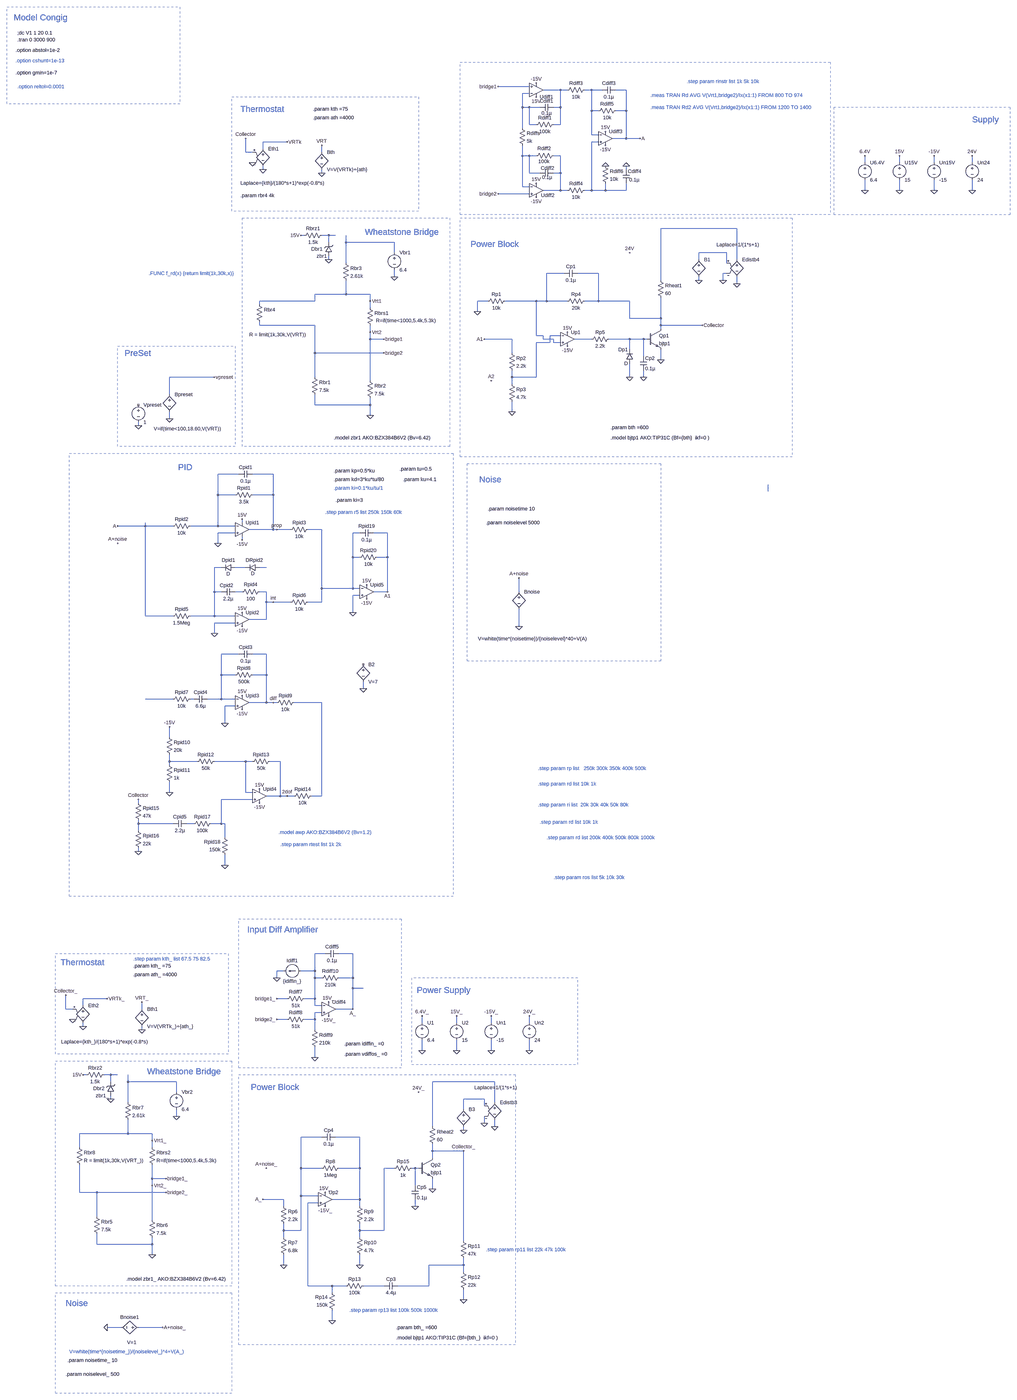
[diagram p0: schematic pid_temp2.asc, whole sheet]
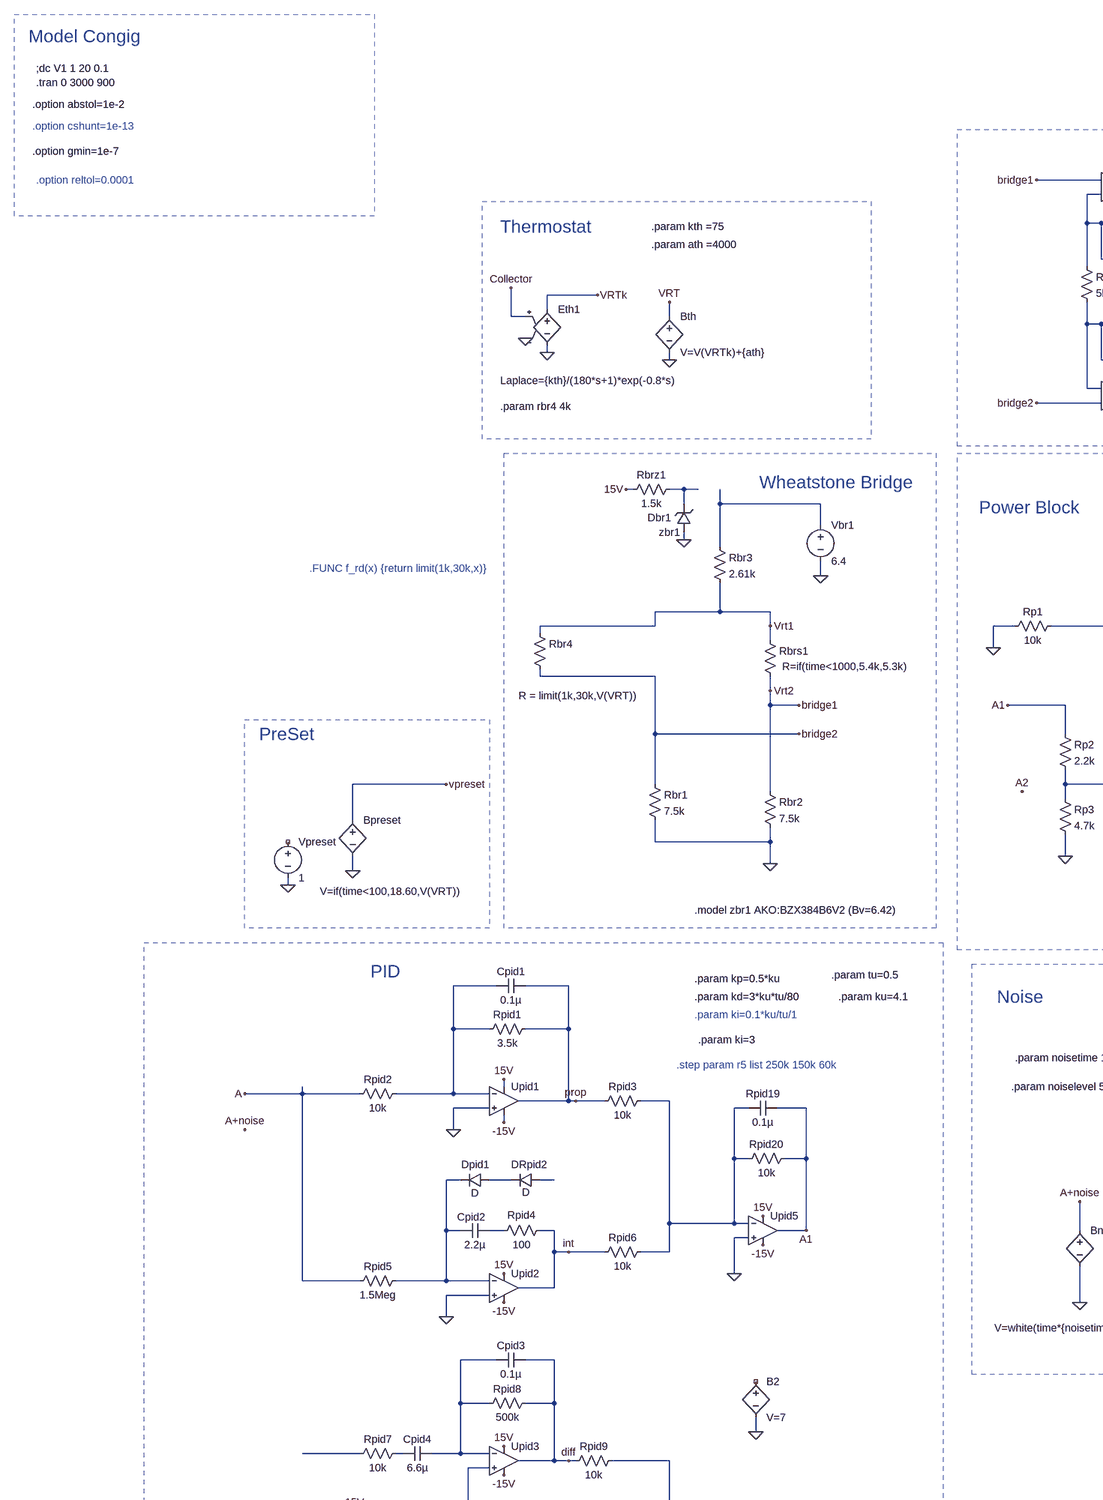
[diagram p1: schematic pid_temp2.asc, part, row 1 of 2, column 1 of 2]
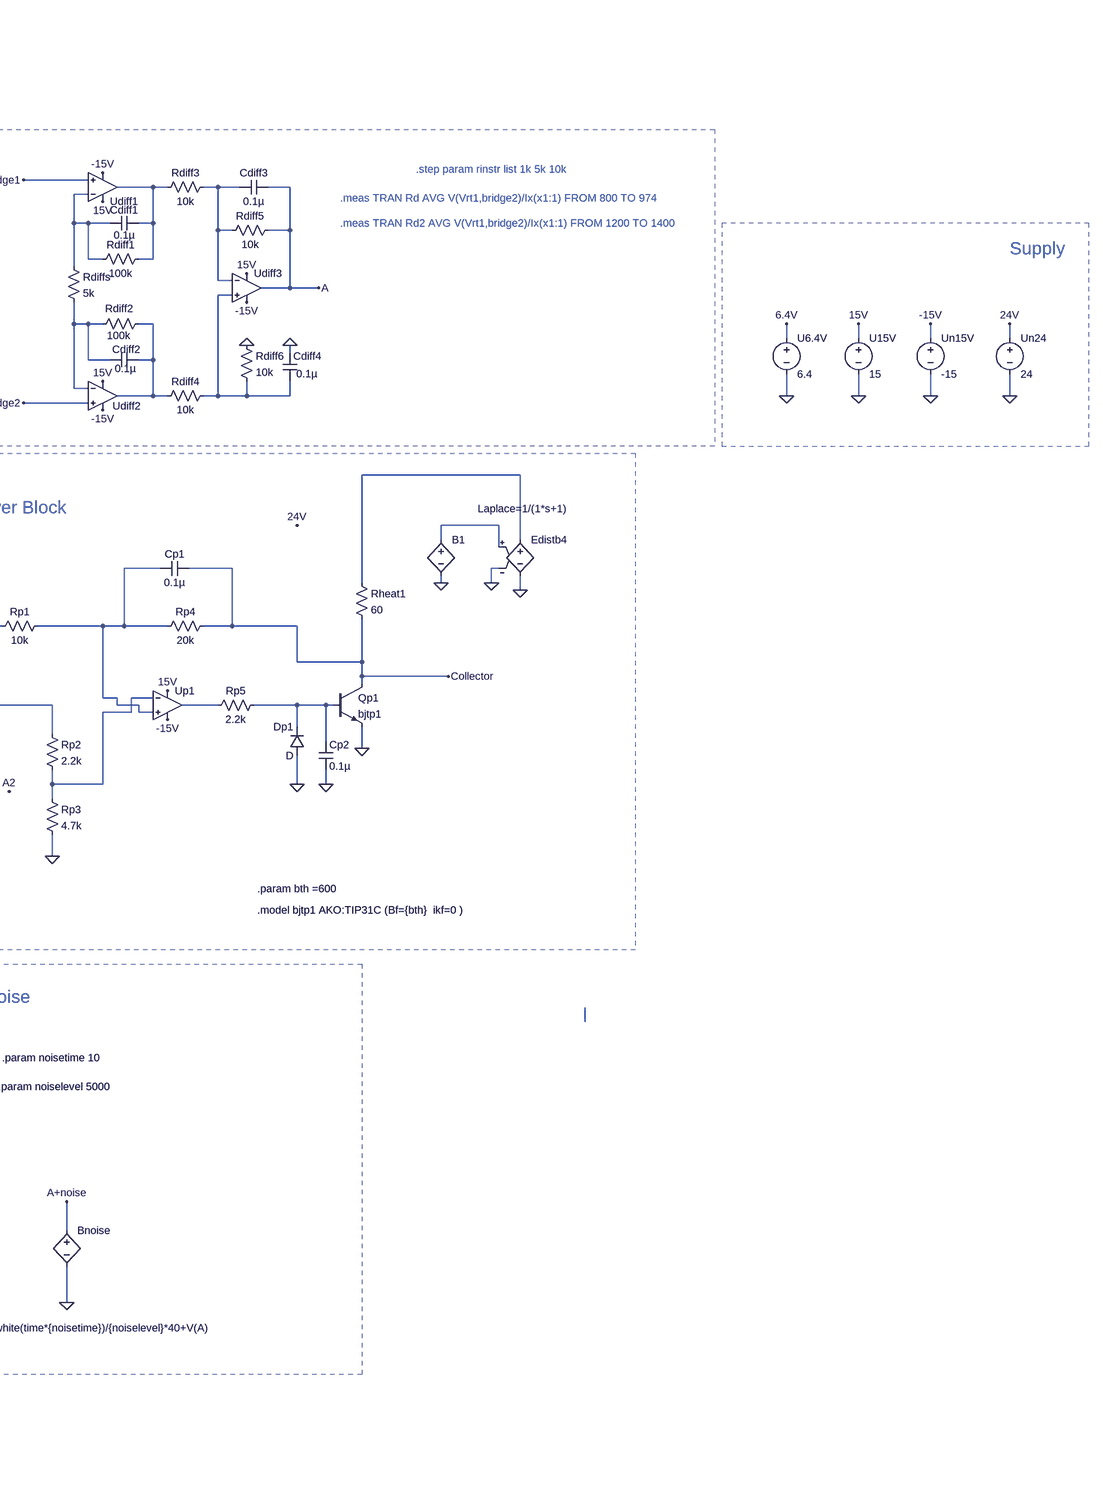
[diagram p2: schematic pid_temp2.asc, part, row 1 of 2, column 2 of 2]
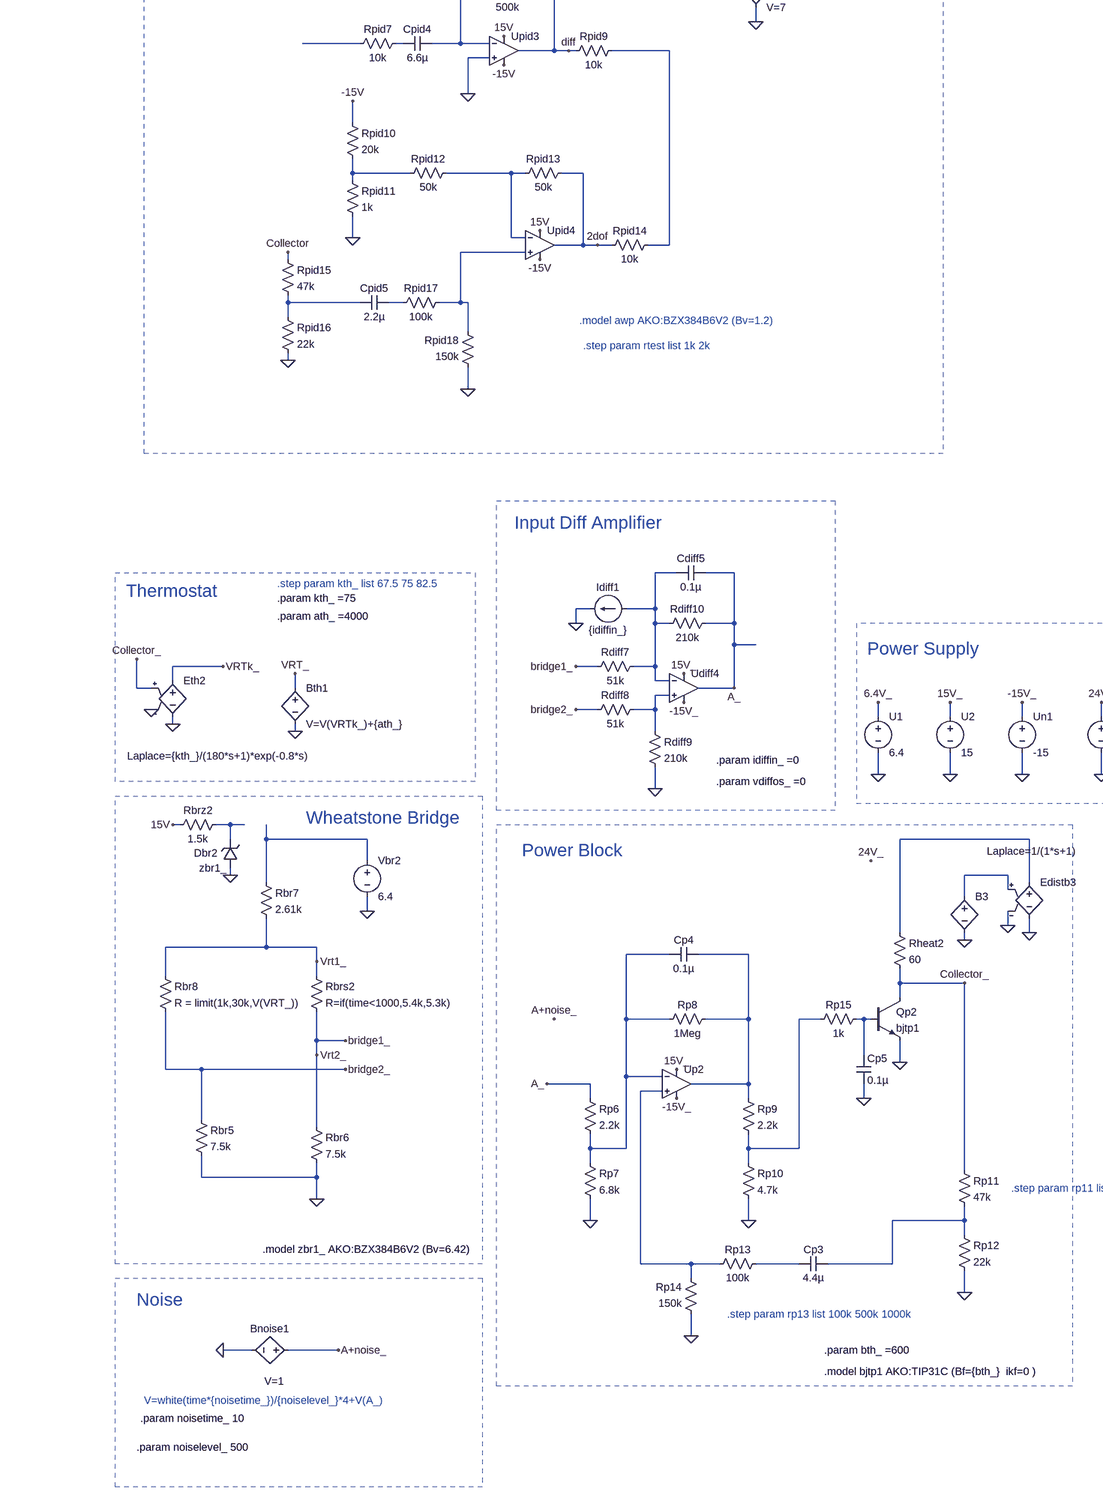
[diagram p3: schematic pid_temp2.asc, part, row 2 of 2, column 1 of 2]
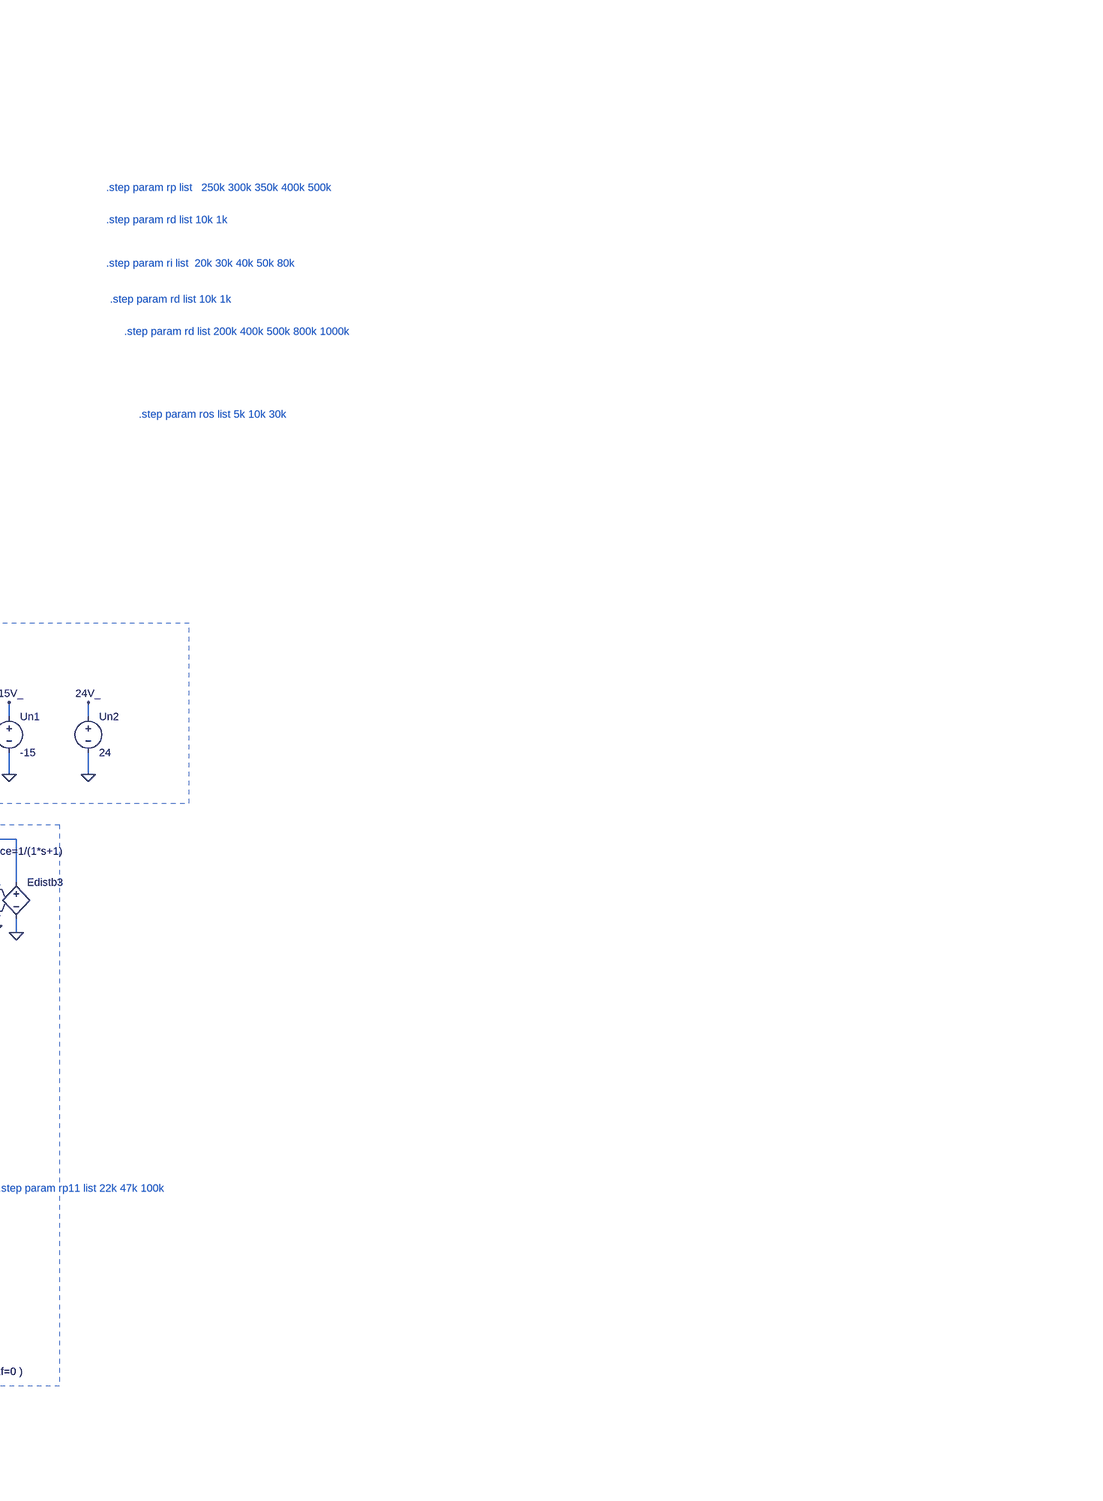
[diagram p4: schematic pid_temp2.asc, part, row 2 of 2, column 2 of 2]
pid_temp2.asc, the LTspice schematic file:
Version 4
SHEET 1 1740 5892
WIRE -720 -864 -864 -864
WIRE -576 -848 -656 -848
WIRE -544 -848 -576 -848
WIRE -432 -848 -464 -848
WIRE -384 -848 -432 -848
WIRE -272 -848 -320 -848
WIRE -720 -832 -752 -832
WIRE -752 -768 -752 -832
WIRE -720 -768 -752 -768
WIRE -672 -768 -720 -768
WIRE -576 -768 -576 -848
WIRE -576 -768 -608 -768
WIRE -432 -752 -432 -848
WIRE -400 -752 -432 -752
WIRE -272 -752 -272 -848
WIRE -272 -752 -320 -752
WIRE -720 -688 -720 -768
WIRE -688 -688 -720 -688
WIRE -576 -688 -576 -768
WIRE -576 -688 -608 -688
WIRE -752 -672 -752 -768
WIRE -432 -640 -432 -752
WIRE -400 -640 -432 -640
WIRE -272 -624 -272 -752
WIRE -272 -624 -336 -624
WIRE -208 -624 -272 -624
WIRE -1840 -608 -1952 -608
WIRE -400 -608 -432 -608
WIRE -1952 -576 -1952 -608
WIRE -2032 -560 -2032 -624
WIRE -2000 -560 -2032 -560
WIRE -1680 -560 -1680 -592
WIRE -752 -544 -752 -592
WIRE -720 -544 -752 -544
WIRE -688 -544 -720 -544
WIRE -576 -544 -608 -544
WIRE 832 -512 832 -544
WIRE 992 -512 992 -544
WIRE 1152 -512 1152 -544
WIRE 1328 -512 1328 -544
WIRE -1952 -480 -1952 -496
WIRE -272 -480 -272 -496
WIRE -1680 -464 -1680 -480
WIRE -720 -464 -720 -544
WIRE -672 -464 -720 -464
WIRE -576 -464 -576 -544
WIRE -576 -464 -608 -464
WIRE -752 -400 -752 -544
WIRE -720 -400 -752 -400
WIRE -576 -384 -576 -464
WIRE -576 -384 -656 -384
WIRE -544 -384 -576 -384
WIRE -432 -384 -432 -608
WIRE -432 -384 -464 -384
WIRE -368 -384 -368 -416
WIRE -368 -384 -432 -384
WIRE -272 -384 -272 -416
WIRE -272 -384 -368 -384
WIRE 832 -384 832 -432
WIRE 992 -384 992 -432
WIRE 1152 -384 1152 -432
WIRE 1328 -384 1328 -432
WIRE -720 -368 -864 -368
WIRE 240 -208 -112 -208
WIRE -1760 -176 -1776 -176
WIRE -1648 -176 -1680 -176
WIRE -1616 -176 -1648 -176
WIRE -1648 -144 -1648 -176
WIRE -1568 -144 -1568 -176
WIRE -1344 -144 -1568 -144
WIRE -1344 -96 -1344 -144
WIRE 192 -96 64 -96
WIRE -1648 -64 -1648 -80
WIRE 64 -64 64 -96
WIRE 240 -64 240 -208
WIRE -1568 -48 -1568 -144
WIRE 192 -48 192 -96
WIRE -560 0 -640 0
WIRE -400 0 -496 0
WIRE 192 0 176 0
WIRE -1344 16 -1344 -16
WIRE -112 32 -112 -208
WIRE 64 32 64 16
WIRE 176 32 176 0
WIRE 240 48 240 16
WIRE -1568 96 -1568 32
WIRE -1568 96 -1712 96
WIRE -1456 96 -1568 96
WIRE -1712 128 -1712 96
WIRE -1712 128 -1968 128
WIRE -1456 128 -1456 96
WIRE -912 128 -960 128
WIRE -688 128 -832 128
WIRE -640 128 -640 0
WIRE -640 128 -688 128
WIRE -544 128 -640 128
WIRE -400 128 -400 0
WIRE -400 128 -464 128
WIRE -256 128 -400 128
WIRE -1968 144 -1968 128
WIRE -1456 160 -1456 128
WIRE -960 176 -960 128
WIRE -256 208 -256 128
WIRE -112 208 -112 112
WIRE -112 208 -256 208
WIRE -1968 240 -1968 224
WIRE -1712 240 -1968 240
WIRE -112 240 -112 208
WIRE 80 240 -112 240
WIRE -112 256 -112 240
WIRE -1456 272 -1456 240
WIRE -688 288 -688 128
WIRE -656 288 -688 288
WIRE -576 288 -624 288
WIRE -1456 304 -1456 272
WIRE -1392 304 -1456 304
WIRE -800 304 -928 304
WIRE -656 304 -656 288
WIRE -608 304 -656 304
WIRE -432 304 -512 304
WIRE -256 304 -352 304
WIRE -192 304 -256 304
WIRE -176 304 -192 304
WIRE -624 320 -624 288
WIRE -624 320 -688 320
WIRE -608 320 -608 304
WIRE -576 320 -608 320
WIRE -256 352 -256 304
WIRE -1712 368 -1712 240
WIRE -1392 368 -1712 368
WIRE -800 368 -800 304
WIRE -192 384 -192 304
WIRE -112 400 -112 352
WIRE -2176 480 -2384 480
WIRE -1712 480 -1712 368
WIRE -800 480 -800 448
WIRE -688 480 -688 320
WIRE -688 480 -800 480
WIRE -256 480 -256 416
WIRE -192 480 -192 448
WIRE -1456 496 -1456 304
WIRE -800 512 -800 480
WIRE -2384 560 -2384 480
WIRE -1712 608 -1712 560
WIRE -1456 608 -1456 576
WIRE -1456 608 -1712 608
WIRE -800 640 -800 592
WIRE -1456 656 -1456 608
WIRE -2384 672 -2384 640
WIRE -2528 704 -2528 688
WIRE -2064 928 -2160 928
WIRE -1904 928 -2000 928
WIRE 384 1008 384 976
WIRE -2160 1024 -2160 928
WIRE -2080 1024 -2160 1024
WIRE -1904 1024 -1904 928
WIRE -1904 1024 -2000 1024
WIRE -2048 1152 -2048 1136
WIRE -2496 1168 -2496 1152
WIRE -2496 1168 -2624 1168
WIRE -2368 1168 -2496 1168
WIRE -2160 1168 -2160 1024
WIRE -2160 1168 -2288 1168
WIRE -2080 1168 -2160 1168
WIRE -1904 1184 -1904 1024
WIRE -1904 1184 -2016 1184
WIRE -1888 1184 -1904 1184
WIRE -1824 1184 -1888 1184
WIRE -1680 1184 -1744 1184
WIRE -2080 1200 -2160 1200
WIRE -1504 1200 -1536 1200
WIRE -1376 1200 -1440 1200
WIRE -2048 1232 -2048 1216
WIRE -2160 1248 -2160 1200
WIRE -1536 1312 -1536 1200
WIRE -1504 1312 -1536 1312
WIRE -1376 1312 -1376 1200
WIRE -1376 1312 -1424 1312
WIRE -2144 1360 -2176 1360
WIRE -2032 1360 -2080 1360
WIRE -1936 1360 -1968 1360
WIRE -1680 1456 -1680 1184
WIRE -1536 1456 -1536 1312
WIRE -1536 1456 -1680 1456
WIRE -1504 1456 -1536 1456
WIRE -2176 1472 -2176 1360
WIRE -2144 1472 -2176 1472
WIRE -2048 1472 -2080 1472
WIRE -1936 1472 -1968 1472
WIRE -1376 1472 -1376 1312
WIRE -1376 1472 -1440 1472
WIRE -768 1472 -768 1408
WIRE -1504 1488 -1536 1488
WIRE -1936 1520 -1936 1472
WIRE -1904 1520 -1936 1520
WIRE -1824 1520 -1904 1520
WIRE -1680 1520 -1680 1456
WIRE -1680 1520 -1744 1520
WIRE -1536 1568 -1536 1488
WIRE -2496 1584 -2496 1168
WIRE -2368 1584 -2496 1584
WIRE -2176 1584 -2176 1472
WIRE -2176 1584 -2288 1584
WIRE -2080 1584 -2176 1584
WIRE -1936 1600 -1936 1520
WIRE -1936 1600 -2016 1600
WIRE -2080 1616 -2176 1616
WIRE -768 1632 -768 1552
WIRE -2176 1664 -2176 1616
WIRE -2064 1760 -2144 1760
WIRE -1936 1760 -2000 1760
WIRE -2144 1856 -2144 1760
WIRE -2080 1856 -2144 1856
WIRE -1936 1856 -1936 1760
WIRE -1936 1856 -2000 1856
WIRE -1488 1920 -1488 1888
WIRE -2368 1968 -2496 1968
WIRE -2272 1968 -2288 1968
WIRE -2144 1968 -2144 1856
WIRE -2144 1968 -2208 1968
WIRE -2080 1968 -2144 1968
WIRE -1936 1984 -1936 1856
WIRE -1936 1984 -2016 1984
WIRE -1904 1984 -1936 1984
WIRE -1888 1984 -1904 1984
WIRE -1680 1984 -1808 1984
WIRE -2080 2000 -2128 2000
WIRE -2128 2080 -2128 2000
WIRE -2384 2144 -2384 2096
WIRE -2384 2256 -2384 2224
WIRE -2256 2256 -2384 2256
WIRE -2032 2256 -2176 2256
WIRE -2000 2256 -2032 2256
WIRE -1872 2256 -1920 2256
WIRE -2384 2272 -2384 2256
WIRE -2384 2400 -2384 2352
WIRE -2032 2400 -2032 2256
WIRE -2000 2400 -2032 2400
WIRE -1872 2416 -1872 2256
WIRE -1872 2416 -1936 2416
WIRE -1840 2416 -1872 2416
WIRE -1808 2416 -1840 2416
WIRE -1680 2416 -1680 1984
WIRE -1680 2416 -1728 2416
WIRE -2000 2432 -2144 2432
WIRE -2528 2448 -2528 2432
WIRE -2528 2544 -2528 2528
WIRE -2368 2544 -2528 2544
WIRE -2272 2544 -2304 2544
WIRE -2144 2544 -2144 2432
WIRE -2144 2544 -2192 2544
WIRE -2128 2544 -2144 2544
WIRE -2528 2576 -2528 2544
WIRE -2128 2608 -2128 2544
WIRE -2528 2672 -2528 2656
WIRE -2128 2736 -2128 2688
WIRE -1664 3840 -1712 3840
WIRE -1536 3840 -1600 3840
WIRE -1856 3920 -1888 3920
WIRE -1712 3920 -1712 3840
WIRE -1712 3920 -1776 3920
WIRE -1888 3952 -1888 3920
WIRE -1712 3952 -1712 3920
WIRE -1680 3952 -1712 3952
WIRE -1536 3952 -1536 3840
WIRE -1536 3952 -1600 3952
WIRE -1536 4000 -1536 3952
WIRE -1488 4000 -1536 4000
WIRE -2672 4048 -2784 4048
WIRE -1840 4048 -1888 4048
WIRE -1712 4048 -1712 3952
WIRE -1712 4048 -1760 4048
WIRE -2784 4080 -2784 4048
WIRE -1712 4080 -1712 4048
WIRE -1680 4080 -1712 4080
WIRE -2864 4096 -2864 4032
WIRE -2832 4096 -2864 4096
WIRE -2512 4096 -2512 4064
WIRE -1536 4096 -1536 4000
WIRE -1536 4096 -1616 4096
WIRE -1680 4112 -1712 4112
WIRE -1840 4144 -1888 4144
WIRE -1712 4144 -1712 4112
WIRE -1712 4144 -1760 4144
WIRE -1216 4160 -1216 4128
WIRE -1056 4160 -1056 4128
WIRE -896 4160 -896 4128
WIRE -720 4160 -720 4128
WIRE -2784 4176 -2784 4160
WIRE -2512 4192 -2512 4176
WIRE -1712 4192 -1712 4144
WIRE -1216 4288 -1216 4240
WIRE -1056 4288 -1056 4240
WIRE -896 4288 -896 4240
WIRE -720 4288 -720 4240
WIRE -1712 4320 -1712 4272
WIRE -2768 4400 -2784 4400
WIRE -2656 4400 -2688 4400
WIRE -2624 4400 -2656 4400
WIRE -2656 4432 -2656 4400
WIRE -2576 4432 -2576 4400
WIRE -2352 4432 -2576 4432
WIRE -880 4432 -1168 4432
WIRE -2352 4480 -2352 4432
WIRE -2656 4512 -2656 4496
WIRE -928 4512 -1024 4512
WIRE -2576 4528 -2576 4432
WIRE -880 4528 -880 4432
WIRE -928 4544 -928 4512
WIRE -1024 4560 -1024 4512
WIRE -2352 4592 -2352 4560
WIRE -928 4624 -928 4592
WIRE -1168 4640 -1168 4432
WIRE -880 4640 -880 4608
WIRE -1024 4656 -1024 4640
WIRE -2576 4672 -2576 4608
WIRE -2576 4672 -2800 4672
WIRE -2464 4672 -2576 4672
WIRE -1680 4688 -1776 4688
WIRE -1504 4688 -1616 4688
WIRE -2464 4704 -2464 4672
WIRE -2800 4736 -2800 4672
WIRE -2464 4736 -2464 4704
WIRE -1168 4752 -1168 4720
WIRE -1024 4752 -1168 4752
WIRE -1168 4784 -1168 4752
WIRE -1776 4832 -1776 4688
WIRE -1680 4832 -1776 4832
WIRE -1504 4832 -1504 4688
WIRE -1504 4832 -1600 4832
WIRE -1344 4832 -1392 4832
WIRE -1248 4832 -1264 4832
WIRE -1232 4832 -1248 4832
WIRE -2464 4880 -2464 4816
WIRE -2400 4880 -2464 4880
WIRE -2464 4912 -2464 4880
WIRE -1248 4912 -1248 4832
WIRE -1168 4928 -1168 4880
WIRE -2800 4944 -2800 4816
WIRE -2720 4944 -2800 4944
WIRE -2400 4944 -2720 4944
WIRE -1776 4960 -1776 4832
WIRE -1696 4960 -1776 4960
WIRE -1856 4976 -1952 4976
WIRE -1504 4976 -1504 4832
WIRE -1504 4976 -1632 4976
WIRE -1696 4992 -1744 4992
WIRE -1856 5008 -1856 4976
WIRE -1504 5008 -1504 4976
WIRE -1248 5008 -1248 4976
WIRE -2720 5056 -2720 4944
WIRE -2464 5072 -2464 4912
WIRE -1856 5120 -1856 5088
WIRE -1776 5120 -1776 4960
WIRE -1776 5120 -1856 5120
WIRE -1504 5120 -1504 5088
WIRE -1392 5120 -1392 4832
WIRE -1392 5120 -1504 5120
WIRE -1856 5152 -1856 5120
WIRE -1504 5152 -1504 5120
WIRE -1024 5168 -1024 4752
WIRE -2720 5184 -2720 5136
WIRE -2464 5184 -2464 5152
WIRE -2464 5184 -2720 5184
WIRE -2464 5232 -2464 5184
WIRE -1856 5280 -1856 5232
WIRE -1504 5280 -1504 5232
WIRE -1024 5280 -1024 5248
WIRE -1024 5280 -1184 5280
WIRE -1024 5312 -1024 5280
WIRE -1744 5376 -1744 4992
WIRE -1632 5376 -1744 5376
WIRE -1568 5376 -1632 5376
WIRE -1392 5376 -1488 5376
WIRE -1184 5376 -1184 5280
WIRE -1184 5376 -1328 5376
WIRE -1632 5408 -1632 5376
WIRE -1024 5440 -1024 5392
WIRE -1632 5536 -1632 5488
WIRE -2608 5568 -2672 5568
WIRE -2416 5568 -2528 5568
FLAG 832 -384 0
FLAG 832 -544 6.4V
FLAG 992 -384 0
FLAG 992 -544 15V
FLAG 1152 -384 0
FLAG 1152 -544 -15V
FLAG -688 -416 15V
FLAG -688 -352 -15V
FLAG 1328 -384 0
FLAG 1328 -544 24V
FLAG -864 -864 bridge1
FLAG -864 -368 bridge2
FLAG -208 -624 A
FLAG -928 304 A1
FLAG -1376 1472 A1
FLAG -2624 1168 A
FLAG -2048 1232 -15V
FLAG -2048 1136 15V
FLAG -2048 1632 -15V
FLAG -2048 1568 15V
FLAG -2048 2016 -15V
FLAG -2048 1952 15V
FLAG -1472 1504 -15V
FLAG -1472 1440 15V
FLAG -2160 1248 0
FLAG -2176 1664 0
FLAG -2128 2080 0
FLAG -800 640 0
FLAG -112 400 0
FLAG -256 -96 24V
FLAG -192 480 0
FLAG 80 240 Collector
FLAG -544 336 -15V
FLAG -544 272 15V
FLAG -896 496 A2
FLAG -256 480 0
FLAG -960 176 0
FLAG -2384 672 0
FLAG -2528 704 0
FLAG -1904 1520 int
FLAG -1888 1184 prop
FLAG -1904 1984 diff
FLAG -2176 480 vpreset
FLAG -1968 2448 -15V
FLAG -1968 2384 15V
FLAG -2384 2400 0
FLAG -368 -496 0
FLAG -272 -496 0
FLAG -688 -816 15V
FLAG -688 -880 -15V
FLAG -368 -592 -15V
FLAG -368 -656 15V
FLAG -2384 2096 -15V
FLAG -2528 2432 Collector
FLAG -2128 2736 0
FLAG -2528 2672 0
FLAG -1840 2416 2dof
FLAG -1536 1568 0
FLAG -768 1632 0
FLAG -768 1408 A+noise
FLAG -2624 1248 A+noise
FLAG -2000 -512 0
FLAG -1952 -480 0
FLAG -1840 -608 VRTk
FLAG -2032 -624 Collector
FLAG -1680 -464 0
FLAG -1680 -592 VRT
FLAG -1456 656 0
FLAG -1392 304 bridge1
FLAG -1392 368 bridge2
FLAG -1456 128 Vrt1
FLAG -1456 272 Vrt2
FLAG -1776 -176 15V
FLAG -1648 -64 0
FLAG -1344 16 0
FLAG 64 32 0
FLAG -1488 1920 0
FLAG -1216 4288 0
FLAG -1216 4128 6.4V_
FLAG -2464 5232 0
FLAG -1056 4288 0
FLAG -1056 4128 15V_
FLAG -896 4288 0
FLAG -896 4128 -15V_
FLAG -1648 4064 15V_
FLAG -1648 4128 -15V_
FLAG -1712 4320 0
FLAG -1856 5280 0
FLAG -1664 5008 -15V_
FLAG -1664 4944 15V_
FLAG -1504 5280 0
FLAG -1168 4928 0
FLAG -720 4288 0
FLAG -720 4128 24V_
FLAG -1024 5440 0
FLAG -1632 5536 0
FLAG -1248 5008 0
FLAG -2400 4880 bridge1_
FLAG -2400 4944 bridge2_
FLAG -1888 4048 bridge1_
FLAG -1888 4144 bridge2_
FLAG -1536 4096 A_
FLAG -1952 4976 A_
FLAG -1024 4752 Collector_
FLAG -2832 4144 0
FLAG -2784 4176 0
FLAG -2672 4048 VRTk_
FLAG -2864 4032 Collector_
FLAG -2464 4704 Vrt1_
FLAG -2464 4912 Vrt2_
FLAG -2784 4400 15V
FLAG -2656 4512 0
FLAG -1024 4656 0
FLAG -1232 4480 24V_
FLAG -2352 4592 0
FLAG -2672 5568 0
FLAG -2416 5568 A+noise_
FLAG -1936 4832 A+noise_
FLAG -2512 4192 0
FLAG -2512 4064 VRT_
FLAG -1888 3952 0
FLAG -928 4624 0
FLAG -880 4640 0
FLAG 176 32 0
FLAG 240 48 0
DATAFLAG -16 240 ""
DATAFLAG -1696 2416 ""
DATAFLAG -2704 4944 ""
DATAFLAG -2432 4880 ""
DATAFLAG -1488 4000 ""
DATAFLAG -1024 4896 ""
DATAFLAG -1856 5120 ""
DATAFLAG -1024 5280 ""
SYMBOL voltage 832 -528 R0
WINDOW 123 0 0 Left 0
WINDOW 39 0 0 Left 0
SYMATTR InstName U6.4V
SYMATTR Value 6.4
SYMBOL voltage 992 -528 R0
WINDOW 123 0 0 Left 0
WINDOW 39 0 0 Left 0
SYMATTR InstName U15V
SYMATTR Value 15
SYMBOL voltage 1152 -528 R0
WINDOW 123 0 0 Left 0
WINDOW 39 0 0 Left 0
SYMATTR InstName Un15V
SYMATTR Value -15
SYMBOL voltage 1328 -528 R0
WINDOW 123 0 0 Left 0
WINDOW 39 0 0 Left 0
SYMATTR InstName Un24
SYMATTR Value 24
SYMBOL res -1984 1008 R90
WINDOW 0 0 56 VBottom 2
WINDOW 3 32 56 VTop 2
SYMATTR InstName Rpid1
SYMATTR Value 3.5k
SYMBOL res -2272 1152 R90
WINDOW 0 0 56 VBottom 2
WINDOW 3 32 56 VTop 2
SYMATTR InstName Rpid2
SYMATTR Value 10k
SYMBOL cap -2080 1456 R90
WINDOW 0 2 40 VBottom 2
WINDOW 3 32 32 VTop 2
SYMATTR InstName Cpid2
SYMATTR Value 2.2µ
SYMBOL cap -2208 1952 R90
WINDOW 0 0 32 VBottom 2
WINDOW 3 32 32 VTop 2
SYMATTR InstName Cpid4
SYMATTR Value 6.6µ
SYMBOL res -2272 1568 R90
WINDOW 0 0 56 VBottom 2
WINDOW 3 32 56 VTop 2
SYMATTR InstName Rpid5
SYMATTR Value 1.5Meg
SYMBOL res -1984 1840 R90
WINDOW 0 0 56 VBottom 2
WINDOW 3 32 56 VTop 2
SYMATTR InstName Rpid8
SYMATTR Value 500k
SYMBOL res -1408 1296 R90
WINDOW 0 0 56 VBottom 2
WINDOW 3 32 56 VTop 2
SYMATTR InstName Rpid20
SYMATTR Value 10k
SYMBOL res -1728 1168 R90
WINDOW 0 0 56 VBottom 2
WINDOW 3 32 56 VTop 2
SYMATTR InstName Rpid3
SYMATTR Value 10k
SYMBOL res -1728 1504 R90
WINDOW 0 0 56 VBottom 2
WINDOW 3 32 56 VTop 2
SYMATTR InstName Rpid6
SYMATTR Value 10k
SYMBOL res -1792 1968 R90
WINDOW 0 0 56 VBottom 2
WINDOW 3 32 56 VTop 2
SYMATTR InstName Rpid9
SYMATTR Value 10k
SYMBOL res -2272 1952 R90
WINDOW 0 0 56 VBottom 2
WINDOW 3 32 56 VTop 2
SYMATTR InstName Rpid7
SYMATTR Value 10k
SYMBOL cap -2000 1744 R90
WINDOW 0 0 32 VBottom 2
WINDOW 3 32 32 VTop 2
SYMATTR InstName Cpid3
SYMATTR Value 0.1µ
SYMBOL cap -2000 912 R90
WINDOW 0 0 32 VBottom 2
WINDOW 3 32 32 VTop 2
SYMATTR InstName Cpid1
SYMATTR Value 0.1µ
SYMBOL cap -1440 1184 R90
WINDOW 0 0 32 VBottom 2
WINDOW 3 32 32 VTop 2
SYMATTR InstName Rpid19
SYMATTR Value 0.1µ
SYMBOL res -816 352 R0
SYMATTR InstName Rp2
SYMATTR Value 2.2k
SYMBOL res -816 496 R0
SYMATTR InstName Rp3
SYMATTR Value 4.7k
SYMBOL npn -176 256 R0
SYMATTR InstName Qp1
SYMATTR Value bjtp1
SYMBOL res -128 16 R0
SYMATTR InstName Rheat1
SYMATTR Value 60
SYMBOL res -336 288 R90
WINDOW 0 0 56 VBottom 2
WINDOW 3 32 56 VTop 2
SYMATTR InstName Rp5
SYMATTR Value 2.2k
SYMBOL cap -208 384 R0
SYMATTR InstName Cp2
SYMATTR Value 0.1µ
SYMBOL diode -240 416 R180
WINDOW 0 24 64 Left 2
WINDOW 3 24 0 Left 2
SYMATTR InstName Dp1
SYMBOL res -448 112 R90
WINDOW 0 0 56 VBottom 2
WINDOW 3 32 56 VTop 2
SYMATTR InstName Rp4
SYMATTR Value 20k
SYMBOL res -816 112 R90
WINDOW 0 0 56 VBottom 2
WINDOW 3 32 56 VTop 2
SYMATTR InstName Rp1
SYMATTR Value 10k
SYMBOL cap -496 -16 R90
WINDOW 0 0 32 VBottom 2
WINDOW 3 32 32 VTop 2
SYMATTR InstName Cp1
SYMATTR Value 0.1µ
SYMBOL bv -2384 544 R0
WINDOW 3 -73 174 Left 2
SYMATTR Value V=if(time<100,18.60,V(VRT))
SYMATTR InstName Bpreset
SYMBOL voltage -2528 592 R0
WINDOW 123 0 0 Left 0
WINDOW 39 0 0 Left 0
SYMATTR InstName Vpreset
SYMATTR Value 1
SYMBOL diode -2080 1344 R90
WINDOW 0 -3 31 VBottom 2
WINDOW 3 29 32 VTop 2
SYMATTR InstName Dpid1
SYMBOL res -1904 2240 R90
WINDOW 0 0 56 VBottom 2
WINDOW 3 32 56 VTop 2
SYMATTR InstName Rpid13
SYMATTR Value 50k
SYMBOL res -1712 2400 R90
WINDOW 0 0 56 VBottom 2
WINDOW 3 32 56 VTop 2
SYMATTR InstName Rpid14
SYMATTR Value 10k
SYMBOL res -768 -688 R0
SYMATTR InstName Rdiffs
SYMATTR Value 5k
SYMBOL res -592 -704 R90
WINDOW 0 0 56 VBottom 2
WINDOW 3 32 56 VTop 2
SYMATTR InstName Rdiff1
SYMATTR Value 100k
SYMBOL res -592 -560 R90
WINDOW 0 -2 59 VBottom 2
WINDOW 3 27 60 VTop 2
SYMATTR InstName Rdiff2
SYMATTR Value 100k
SYMBOL cap -608 -784 R90
WINDOW 0 3 32 VBottom 2
WINDOW 3 27 32 VTop 2
SYMATTR InstName Cdiff1
SYMATTR Value 0.1µ
SYMBOL cap -608 -480 R90
WINDOW 0 9 27 VBottom 2
WINDOW 3 20 29 VTop 2
SYMATTR InstName Cdiff2
SYMATTR Value 0.1µ
SYMBOL res -448 -864 R90
WINDOW 0 0 56 VBottom 2
WINDOW 3 32 56 VTop 2
SYMATTR InstName Rdiff3
SYMATTR Value 10k
SYMBOL res -448 -400 R90
WINDOW 0 0 56 VBottom 2
WINDOW 3 32 56 VTop 2
SYMATTR InstName Rdiff4
SYMATTR Value 10k
SYMBOL res -384 -512 R0
SYMATTR InstName Rdiff6
SYMATTR Value 10k
SYMBOL res -304 -768 R90
WINDOW 0 0 56 VBottom 2
WINDOW 3 32 56 VTop 2
SYMATTR InstName Rdiff5
SYMATTR Value 10k
SYMBOL cap -288 -480 R0
WINDOW 3 30 47 Left 2
SYMATTR Value 0.1µ
SYMATTR InstName Cdiff4
SYMBOL cap -320 -864 R90
WINDOW 0 0 32 VBottom 2
WINDOW 3 32 32 VTop 2
SYMATTR InstName Cdiff3
SYMATTR Value 0.1µ
SYMBOL res -1952 1456 R90
WINDOW 0 -2 57 VBottom 2
WINDOW 3 32 56 VTop 2
SYMATTR InstName Rpid4
SYMATTR Value 100
SYMBOL res -2400 2128 R0
SYMATTR InstName Rpid10
SYMATTR Value 20k
SYMBOL res -2400 2256 R0
SYMATTR InstName Rpid11
SYMATTR Value 1k
SYMBOL cap -2304 2528 R90
WINDOW 0 0 32 VBottom 2
WINDOW 3 32 32 VTop 2
SYMATTR InstName Cpid5
SYMATTR Value 2.2µ
SYMBOL res -2176 2528 R90
WINDOW 0 0 56 VBottom 2
WINDOW 3 32 56 VTop 2
SYMATTR InstName Rpid17
SYMATTR Value 100k
SYMBOL res -2112 2704 R180
WINDOW 0 36 76 Left 2
WINDOW 3 36 40 Left 2
SYMATTR InstName Rpid18
SYMATTR Value 150k
SYMBOL res -2544 2432 R0
SYMATTR InstName Rpid15
SYMATTR Value 47k
SYMBOL res -2544 2560 R0
SYMATTR InstName Rpid16
SYMATTR Value 22k
SYMBOL diode -1968 1344 R90
WINDOW 0 -3 24 VBottom 2
WINDOW 3 28 31 VTop 2
SYMATTR InstName DRpid2
SYMBOL res -2160 2240 R90
WINDOW 0 0 56 VBottom 2
WINDOW 3 32 56 VTop 2
SYMATTR InstName Rpid12
SYMATTR Value 50k
SYMBOL bv -768 1456 R0
WINDOW 3 -190 233 Left 2
SYMATTR Value V=white(time*{noisetime})/{noiselevel}*40+V(A)
SYMATTR InstName Bnoise
SYMBOL e -1952 -592 R0
WINDOW 3 -104 174 Left 2
SYMATTR Value Laplace={kth}/(180*s+1)*exp(-0.8*s)
SYMATTR InstName Eth1
SYMBOL bv -1680 -576 R0
SYMATTR InstName Bth
SYMATTR Value V=V(VRTk)+{ath}
SYMBOL res -1728 464 R0
SYMATTR InstName Rbr1
SYMATTR Value 7.5k
SYMBOL res -1472 144 R0
WINDOW 3 43 74 Left 2
SYMATTR Value R=if(time<1000,5.4k,5.3k)
SYMATTR InstName Rbrs1
SYMBOL res -1472 480 R0
SYMATTR InstName Rbr2
SYMATTR Value 7.5k
SYMBOL res -1584 -64 R0
SYMATTR InstName Rbr3
SYMATTR Value 2.61k
SYMBOL zener -1632 -80 R180
WINDOW 0 44 33 Left 2
WINDOW 3 24 0 Left 2
SYMATTR InstName Dbr1
SYMATTR Value zbr1
SYMBOL res -1664 -192 R90
WINDOW 0 0 56 VBottom 2
WINDOW 3 32 56 VTop 2
SYMATTR InstName Rbrz1
SYMATTR Value 1.5k
SYMBOL res -1984 128 R0
WINDOW 3 -31 155 Left 2
SYMATTR Value R = limit(1k,30k,V(VRT))
SYMATTR InstName Rbr4
SYMBOL voltage -1344 -112 R0
WINDOW 123 0 0 Left 0
WINDOW 39 0 0 Left 0
SYMATTR InstName Vbr1
SYMATTR Value 6.4
SYMBOL Opamps\\UniversalOpamp2 -688 -848 M180
SYMATTR InstName Udiff1
SYMATTR Value2 Avol=250k GBW=10Meg Slew=10Meg
SYMBOL Opamps\\UniversalOpamp2 -368 -624 R0
SYMATTR InstName Udiff3
SYMATTR Value2 Avol=250k GBW=10Meg Slew=10Meg
SYMBOL Opamps\\UniversalOpamp2 -688 -384 R0
WINDOW 0 22 23 Left 2
SYMATTR InstName Udiff2
SYMATTR Value2 Avol=250k GBW=10Meg Slew=10Meg
SYMBOL Opamps\\UniversalOpamp2 -544 304 R0
SYMATTR InstName Up1
SYMATTR Value2 Avol=250k GBW=10Meg Slew=10Meg
SYMBOL Opamps\\UniversalOpamp2 -2048 1600 R0
SYMATTR InstName Upid2
SYMATTR Value2 Avol=250k GBW=10Meg Slew=10Meg
SYMBOL Opamps\\UniversalOpamp2 -2048 1984 R0
SYMATTR InstName Upid3
SYMATTR Value2 Avol=250k GBW=10Meg Slew=10Meg
SYMBOL Opamps\\UniversalOpamp2 -1968 2416 R0
SYMATTR InstName Upid4
SYMATTR Value2 Avol=250k GBW=10Meg Slew=10Meg
SYMBOL Opamps\\UniversalOpamp2 -1472 1472 R0
SYMATTR InstName Upid5
SYMATTR Value2 Avol=250k GBW=10Meg Slew=10Meg
SYMBOL Opamps\\UniversalOpamp2 -2048 1184 R0
SYMATTR InstName Upid1
SYMATTR Value2 Avol=250k GBW=10Meg Slew=10Meg
SYMBOL bv 64 -80 R0
WINDOW 3 24 96 Invisible 2
SYMATTR Value V=if(time<2200,24,if(time>2200,if(time<2203,0,24),24))
SYMATTR InstName B1
SYMBOL bv -1488 1792 R0
SYMATTR InstName B2
SYMATTR Value V=7
SYMBOL voltage -1216 4144 R0
WINDOW 123 0 0 Left 0
WINDOW 39 0 0 Left 0
SYMATTR InstName U1
SYMATTR Value 6.4
SYMBOL res -2736 5040 R0
SYMATTR InstName Rbr5
SYMATTR Value 7.5k
SYMBOL res -2480 4720 R0
SYMATTR InstName Rbrs2
SYMATTR Value R=if(time<1000,5.4k,5.3k)
SYMBOL res -2480 5056 R0
SYMATTR InstName Rbr6
SYMATTR Value 7.5k
SYMBOL res -2592 4512 R0
SYMATTR InstName Rbr7
SYMATTR Value 2.61k
SYMBOL voltage -1056 4144 R0
WINDOW 123 0 0 Left 0
WINDOW 39 0 0 Left 0
SYMATTR InstName U2
SYMATTR Value 15
SYMBOL voltage -896 4144 R0
WINDOW 123 0 0 Left 0
WINDOW 39 0 0 Left 0
SYMATTR InstName Un1
SYMATTR Value -15
SYMBOL res -1744 4032 R90
WINDOW 0 0 56 VBottom 2
WINDOW 3 32 56 VTop 2
SYMATTR InstName Rdiff7
SYMATTR Value 51k
SYMBOL res -1744 4128 R90
WINDOW 0 0 56 VBottom 2
WINDOW 3 32 56 VTop 2
SYMATTR InstName Rdiff8
SYMATTR Value 51k
SYMBOL res -1728 4176 R0
SYMATTR InstName Rdiff9
SYMATTR Value 210k
SYMBOL res -1584 3936 R90
WINDOW 0 0 56 VBottom 2
WINDOW 3 32 56 VTop 2
SYMATTR InstName Rdiff10
SYMATTR Value 210k
SYMBOL res -1872 4992 R0
SYMATTR InstName Rp6
SYMATTR Value 2.2k
SYMBOL res -1872 5136 R0
SYMATTR InstName Rp7
SYMATTR Value 6.8k
SYMBOL res -1584 4816 R90
WINDOW 0 0 56 VBottom 2
WINDOW 3 32 56 VTop 2
SYMATTR InstName Rp8
SYMATTR Value 1Meg
SYMBOL res -1520 4992 R0
SYMATTR InstName Rp9
SYMATTR Value 2.2k
SYMBOL res -1520 5136 R0
SYMATTR InstName Rp10
SYMATTR Value 4.7k
SYMBOL res -1184 4624 R0
SYMATTR InstName Rheat2
SYMATTR Value 60
SYMBOL voltage -720 4144 R0
WINDOW 123 0 0 Left 0
WINDOW 39 0 0 Left 0
SYMATTR InstName Un2
SYMATTR Value 24
SYMBOL res -1040 5152 R0
SYMATTR InstName Rp11
SYMATTR Value 47k
SYMBOL res -1040 5296 R0
SYMATTR InstName Rp12
SYMATTR Value 22k
SYMBOL res -1472 5360 R90
WINDOW 0 0 56 VBottom 2
WINDOW 3 32 56 VTop 2
SYMATTR InstName Rp13
SYMATTR Value 100k
SYMBOL res -1616 5504 R180
WINDOW 0 36 76 Left 2
WINDOW 3 36 40 Left 2
SYMATTR InstName Rp14
SYMATTR Value 150k
SYMBOL res -1248 4816 R90
WINDOW 0 0 56 VBottom 2
WINDOW 3 32 56 VTop 2
SYMATTR InstName Rp15
SYMATTR Value 1k
SYMBOL cap -1328 5360 R90
WINDOW 0 0 32 VBottom 2
WINDOW 3 32 32 VTop 2
SYMATTR InstName Cp3
SYMATTR Value 4.4µ
SYMBOL cap -1616 4672 R90
WINDOW 0 0 32 VBottom 2
WINDOW 3 32 32 VTop 2
SYMATTR InstName Cp4
SYMATTR Value 0.1µ
SYMBOL cap -1600 3824 R90
WINDOW 0 0 32 VBottom 2
WINDOW 3 32 32 VTop 2
SYMATTR InstName Cdiff5
SYMATTR Value 0.1µ
SYMBOL cap -1264 4912 R0
SYMATTR InstName Cp5
SYMATTR Value 0.1µ
SYMBOL e -2784 4064 R0
WINDOW 3 -101 183 Left 2
SYMATTR Value Laplace={kth_}/(180*s+1)*exp(-0.8*s)
SYMATTR InstName Eth2
SYMBOL zener -2640 4496 R180
WINDOW 0 44 33 Left 2
WINDOW 3 24 0 Left 2
SYMATTR InstName Dbr2
SYMATTR Value zbr1_
SYMBOL res -2672 4384 R90
WINDOW 0 0 56 VBottom 2
WINDOW 3 32 56 VTop 2
SYMATTR InstName Rbrz2
SYMATTR Value 1.5k
SYMBOL res -2816 4720 R0
SYMATTR InstName Rbr8
SYMATTR Value R = limit(1k,30k,V(VRT_))
SYMBOL bv -1024 4544 R0
WINDOW 3 24 96 Invisible 2
SYMATTR Value V=if(time<2200,24,if(time>2200,if(time<2203,0,24),24))
SYMATTR InstName B3
SYMBOL npn -1232 4784 R0
SYMATTR InstName Qp2
SYMATTR Value bjtp1
SYMBOL Opamps\\UniversalOpamp2 -1648 4096 R0
SYMATTR InstName Udiff4
SYMATTR Value2 Avol=250k GBW=10Meg Slew=10Meg
SYMATTR SpiceLine Ilimit=25m Rail=0 Vos={vdiffos_}
SYMBOL voltage -2352 4464 R0
WINDOW 123 0 0 Left 0
WINDOW 39 0 0 Left 0
SYMATTR InstName Vbr2
SYMATTR Value 6.4
SYMBOL bv -2512 5568 R90
WINDOW 3 54 46 VTop 2
WINDOW 0 -32 56 VBottom 2
SYMATTR Value V=1
SYMATTR InstName Bnoise1
SYMBOL Opamps\\UniversalOpamp2 -1664 4976 R0
SYMATTR InstName Up2
SYMATTR Value2 Avol=250k GBW=10Meg Slew=10Meg
SYMBOL bv -2512 4080 R0
SYMATTR InstName Bth1
SYMATTR Value V=V(VRTk_)+{ath_}
SYMBOL current -1776 3920 M270
WINDOW 0 32 40 VTop 2
WINDOW 3 -32 40 VBottom 2
SYMATTR InstName Idiff1
SYMATTR Value {idiffin_}
SYMBOL e -880 4512 R0
WINDOW 3 -94 -53 Left 2
SYMATTR Value Laplace=1/(1*s+1)
SYMATTR InstName Edistb3
SYMBOL e 240 -80 R0
WINDOW 3 -94 -53 Left 2
SYMATTR Value Laplace=1/(1*s+1)
SYMATTR InstName Edistb4
TEXT -3088 -1080 Left 2 !.tran 0 3000 900
TEXT 1328 -712 Left 4 ;Supply
TEXT -992 -136 Left 4 ;Power Block
TEXT -2344 896 Left 4 ;PID
TEXT -1624 912 Left 2 !.param kp=0.5*ku
TEXT -1624 952 Left 2 !.param kd=3*ku*tu/80
TEXT -1624 992 Left 2 ;.param ki=0.1*ku/tu/1
TEXT -1320 904 Left 2 !.param tu=0.5
TEXT -1304 952 Left 2 !.param ku=4.1
TEXT -1616 1048 Left 2 !.param ki=3
TEXT -2592 368 Left 4 ;PreSet
TEXT -3088 -1112 Left 2 !;dc V1 1 20 0.1
TEXT -3096 -1032 Left 2 !.option abstol=1e-2
TEXT -3096 -984 Left 2 ;.option cshunt=1e-13
TEXT -3096 -928 Left 2 !.option gmin=1e-7
TEXT -3088 -864 Left 2 ;.option reltol=0.0001
TEXT -672 2536 Left 2 ;.step param rd list 10k 1k
TEXT 8 -888 Left 2 ;.step param rinstr list 1k 5k 10k
TEXT -1880 2584 Left 2 ;.model awp AKO:BZX384B6V2 (Bv=1.2)
TEXT -1872 2640 Left 2 ;.step param rtest list 1k 2k
TEXT -160 -824 Left 2 ;.meas TRAN Rd AVG V(Vrt1,bridge2)/Ix(x1:1) FROM 800 TO 974
TEXT -160 -768 Left 2 ;.meas TRAN Rd2 AVG V(Vrt1,bridge2)/Ix(x1:1) FROM 1200 TO 1400
TEXT -608 2792 Left 2 ;.step param ros list 5k 10k 30k
TEXT -640 2608 Left 2 ;.step param rd list 200k 400k 500k 800k 1000k
TEXT -680 2360 Left 2 ;.step param rd list 10k 1k
TEXT -680 2456 Left 2 ;.step param ri list  20k 30k 40k 50k 80k
TEXT -680 2288 Left 2 ;.step param rp list   250k 300k 350k 400k 500k
TEXT -1664 1104 Left 2 ;.step param r5 list 250k 150k 60k
TEXT -912 1088 Left 2 !.param noisetime 10
TEXT -920 1152 Left 2 !.param noiselevel 5000
TEXT -952 952 Left 4 ;Noise
TEXT -2056 -760 Left 4 ;Thermostat
TEXT -1720 -760 Left 2 !.param kth =75
TEXT -1720 -720 Left 2 !.param ath =4000
TEXT -1480 -192 Left 4 ;Wheatstone Bridge
TEXT -1624 760 Left 2 !.model zbr1 AKO:BZX384B6V2 (Bv=6.42)
TEXT -3104 -1184 Left 4 ;Model Congig
TEXT -344 760 Left 2 !.model bjtp1 AKO:TIP31C (Bf={bth}  ikf=0 )
TEXT -344 712 Left 2 !.param bth =600
TEXT -2488 4384 Left 4 ;Wheatstone Bridge
TEXT -1240 4008 Left 4 ;Power Supply
TEXT -2024 3728 Left 4 ;Input Diff Amplifier
TEXT -2888 3880 Left 4 ;Thermostat
TEXT -2008 4456 Left 4 ;Power Block
TEXT -2584 5344 Left 2 !.model zbr1_ AKO:BZX384B6V2 (Bv=6.42)
TEXT -1336 5616 Left 2 !.model bjtp1 AKO:TIP31C (Bf={bth_}  ikf=0 )
TEXT -2864 5456 Left 4 ;Noise
TEXT -2856 5720 Left 2 !.param noisetime_ 10
TEXT -2864 5784 Left 2 !.param noiselevel_ 500
TEXT -2848 5680 Left 2 ;V=white(time*{noisetime_})/{noiselevel_}*4+V(A_)
TEXT -2552 3896 Left 2 !.param kth_ =75
TEXT -2552 3936 Left 2 !.param ath_ =4000
TEXT -1336 5568 Left 2 !.param bth_ =600
TEXT -1576 4304 Left 2 !.param vdiffos_ =0
TEXT -1576 4256 Left 2 !.param idiffin_ =0
TEXT -2552 3864 Left 2 ;.step param kth_ list 67.5 75 82.5
TEXT -920 5208 Left 2 ;.step param rp11 list 22k 47k 100k
TEXT -1552 5488 Left 2 ;.step param rp13 list 100k 500k 1000k
TEXT -2056 -360 Left 2 !.param rbr4 4k
TEXT -2480 0 Left 2 ;.FUNC f_rd(x) {return limit(1k,30k,x)}
RECTANGLE Normal 1504 -768 688 -272 2
RECTANGLE Normal 672 -272 -1040 -976 2
RECTANGLE Normal 496 848 -1040 -256 2
RECTANGLE Normal -1072 2880 -2848 832 2
RECTANGLE Normal -2624 336 -2080 800 2
RECTANGLE Normal -112 1792 -1008 880 2
RECTANGLE Normal -1232 -288 -2096 -816 2
RECTANGLE Normal -1088 800 -2048 -256 2
RECTANGLE Normal -2336 -784 -3136 -1232 2
RECTANGLE Normal -2096 5376 -2912 4336 2
RECTANGLE Normal -496 3952 -1264 4352 2
RECTANGLE Normal -1312 4368 -2064 3680 2
RECTANGLE Normal -2112 4304 -2912 3840 2
RECTANGLE Normal -784 5648 -2064 4400 2
RECTANGLE Normal -2096 5872 -2912 5408 2

The netlist it stands for:
* pid_temp2.asc
V§U6.4V 6.4V 0 6.4
V§U15V 15V 0 15
V§Un15V -15V 0 -15
V§Un24 24V 0 24
Rpid1 prop N015 3.5k
Rpid2 N015 A 10k
Cpid2 N021 N018 2.2µ
Cpid4 N022 N024 6.6µ
Rpid5 N018 A 1.5Meg
Rpid8 diff N022 500k
Rpid20 A1 N017 10k
Rpid3 N017 prop 10k
Rpid6 N017 int 10k
Rpid9 N025 diff 10k
Rpid7 N024 N023 10k
Cpid3 diff N022 0.1µ
Cpid1 prop N015 0.1µ
C§Rpid19 A1 N017 0.1µ
Rp2 A1 N012 2.2k
Rp3 N012 0 4.7k
Qp1 Collector N014 0 0 bjtp1
Rheat1 N007 Collector 60
Rp5 N014 N013 2.2k
Cp2 N014 0 0.1µ
Dp1 0 N014 D
Rp4 Collector N011 20k
Rp1 N011 0 10k
Cp1 Collector N011 0.1µ
Bpreset vpreset 0 V=if(time<100,18.60,V(VRT))
Vpreset NC_01 0 1
Dpid1 N019 N018 D
Rpid13 2dof N027 50k
Rpid14 N025 2dof 10k
Rdiffs N003 N005 5k
Rdiff1 N001 N003 100k
Rdiff2 N006 N005 100k
Cdiff1 N001 N003 0.1µ
Cdiff2 N006 N005 0.1µ
Rdiff3 N002 N001 10k
Rdiff4 N004 N006 10k
Rdiff6 0 N004 10k
Rdiff5 A N002 10k
Cdiff4 0 N004 0.1µ
Cdiff3 A N002 0.1µ
Rpid4 int N021 100
Rpid10 -15V N026 20k
Rpid11 N026 0 1k
Cpid5 N030 N029 2.2µ
Rpid17 N028 N030 100k
Rpid18 0 N028 150k
Rpid15 Collector N029 47k
Rpid16 N029 0 22k
DRpid2 N020 N019 D
Rpid12 N027 N026 50k
Bnoise A+noise 0 V=white(time*{noisetime})/{noiselevel}*40+V(A)
Eth1 VRTk 0 Collector 0 Laplace={kth}/(180*s+1)*exp(-0.8*s)
Bth VRT 0 V=V(VRTk)+{ath}
Rbr1 bridge2 0 7.5k
Rbrs1 Vrt1 Vrt2 R=if(time<1000,5.4k,5.3k)
Rbr2 Vrt2 0 7.5k
Rbr3 N009 Vrt1 2.61k
Dbr1 0 N008 zbr1
Rbrz1 N008 15V 1.5k
Rbr4 Vrt1 bridge2 R = limit(1k,30k,V(VRT))
Vbr1 N009 0 6.4
XUdiff1 Vrt2 N003 15V -15V N001 level.2 Avol=250k GBW=10Meg Slew=10Meg ilimit=25m rail=0 Vos=0 phimargin=45 en=0 enk=0 in=0 ink=0 Rin=500Meg  ; pins IN+ IN- V+ V- OUT
XUdiff3 N004 N002 15V -15V A level.2 Avol=250k GBW=10Meg Slew=10Meg ilimit=25m rail=0 Vos=0 phimargin=45 en=0 enk=0 in=0 ink=0 Rin=500Meg  ; pins IN+ IN- V+ V- OUT
XUdiff2 bridge2 N005 15V -15V N006 level.2 Avol=250k GBW=10Meg Slew=10Meg ilimit=25m rail=0 Vos=0 phimargin=45 en=0 enk=0 in=0 ink=0 Rin=500Meg  ; pins IN+ IN- V+ V- OUT
XUp1 N011 N012 15V -15V N013 level.2 Avol=250k GBW=10Meg Slew=10Meg ilimit=25m rail=0 Vos=0 phimargin=45 en=0 enk=0 in=0 ink=0 Rin=500Meg  ; pins IN+ IN- V+ V- OUT
XUpid2 0 N018 15V -15V int level.2 Avol=250k GBW=10Meg Slew=10Meg ilimit=25m rail=0 Vos=0 phimargin=45 en=0 enk=0 in=0 ink=0 Rin=500Meg  ; pins IN+ IN- V+ V- OUT
XUpid3 0 N022 15V -15V diff level.2 Avol=250k GBW=10Meg Slew=10Meg ilimit=25m rail=0 Vos=0 phimargin=45 en=0 enk=0 in=0 ink=0 Rin=500Meg  ; pins IN+ IN- V+ V- OUT
XUpid4 N028 N027 15V -15V 2dof level.2 Avol=250k GBW=10Meg Slew=10Meg ilimit=25m rail=0 Vos=0 phimargin=45 en=0 enk=0 in=0 ink=0 Rin=500Meg  ; pins IN+ IN- V+ V- OUT
XUpid5 0 N017 15V -15V A1 level.2 Avol=250k GBW=10Meg Slew=10Meg ilimit=25m rail=0 Vos=0 phimargin=45 en=0 enk=0 in=0 ink=0 Rin=500Meg  ; pins IN+ IN- V+ V- OUT
XUpid1 0 N015 15V -15V prop level.2 Avol=250k GBW=10Meg Slew=10Meg ilimit=25m rail=0 Vos=0 phimargin=45 en=0 enk=0 in=0 ink=0 Rin=500Meg  ; pins IN+ IN- V+ V- OUT
B1 N010 0 V=if(time<2200,24,if(time>2200,if(time<2203,0,24),24))
B2 NC_02 0 V=7
V§U1 6.4V_ 0 6.4
Rbr5 bridge2_ 0 7.5k
Rbrs2 Vrt1_ Vrt2_ R=if(time<1000,5.4k,5.3k)
Rbr6 Vrt2_ 0 7.5k
Rbr7 N034 Vrt1_ 2.61k
V§U2 15V_ 0 15
V§Un1 -15V_ 0 -15
Rdiff7 N031 Vrt2_ 51k
Rdiff8 N032 bridge2_ 51k
Rdiff9 N032 0 210k
Rdiff10 A_ N031 210k
Rp6 A_ N037 2.2k
Rp7 N037 0 6.8k
Rp8 N038 N037 1Meg
Rp9 N038 N039 2.2k
Rp10 N039 0 4.7k
Rheat2 N035 Collector_ 60
V§Un2 24V_ 0 24
Rp11 Collector_ N042 47k
Rp12 N042 0 22k
Rp13 N043 N041 100k
Rp14 0 N041 150k
Rp15 N040 N039 1k
Cp3 N042 N043 4.4µ
Cp4 N038 N037 0.1µ
Cdiff5 A_ N031 0.1µ
Cp5 N040 0 0.1µ
Eth2 VRTk_ 0 Collector_ 0 Laplace={kth_}/(180*s+1)*exp(-0.8*s)
Dbr2 0 N033 zbr1_
Rbrz2 N033 15V 1.5k
Rbr8 Vrt1_ bridge2_ R = limit(1k,30k,V(VRT_))
B3 N036 0 V=if(time<2200,24,if(time>2200,if(time<2203,0,24),24))
Qp2 Collector_ N040 0 0 bjtp1
XUdiff4 N032 N031 15V_ -15V_ A_ level.2 Avol=250k GBW=10Meg Slew=10Meg Ilimit=25m Rail=0 Vos={vdiffos_} en=0 enk=0 in=0 ink=0 Rin=500Meg  ; pins IN+ IN- V+ V- OUT
Vbr2 N034 0 6.4
Bnoise1 A+noise_ 0 V=1
XUp2 N041 N037 15V_ -15V_ N038 level.2 Avol=250k GBW=10Meg Slew=10Meg ilimit=25m rail=0 Vos=0 phimargin=45 en=0 enk=0 in=0 ink=0 Rin=500Meg  ; pins IN+ IN- V+ V- OUT
Bth1 VRT_ 0 V=V(VRTk_)+{ath_}
Idiff1 N031 0 {idiffin_}
Edistb3 N035 0 N036 0 Laplace=1/(1*s+1)
Edistb4 N007 0 N010 0 Laplace=1/(1*s+1)
.model D D
.lib standard.dio
.model NPN NPN
.model PNP PNP
.lib standard.bjt
.tran 0 3000 900
* Supply
* Power Block
* PID
.param kp=0.5*ku
.param kd=3*ku*tu/80
* .param ki=0.1*ku/tu/1
.param tu=0.5
.param ku=4.1
.param ki=3
* PreSet
;dc V1 1 20 0.1
.option abstol=1e-2
* .option cshunt=1e-13
.option gmin=1e-7
* .option reltol=0.0001
* .step param rd list 10k 1k
* .step param rinstr list 1k 5k 10k
* .model awp AKO:BZX384B6V2 (Bv=1.2)
* .step param rtest list 1k 2k
* .meas TRAN Rd AVG V(Vrt1,bridge2)/Ix(x1:1) FROM 800 TO 974
* .meas TRAN Rd2 AVG V(Vrt1,bridge2)/Ix(x1:1) FROM 1200 TO 1400
* .step param ros list 5k 10k 30k
* .step param rd list 200k 400k 500k 800k 1000k
* .step param rd list 10k 1k
* .step param ri list  20k 30k 40k 50k 80k
* .step param rp list   250k 300k 350k 400k 500k
* .step param r5 list 250k 150k 60k
.param noisetime 10
.param noiselevel 5000
* Noise
* Thermostat
.param kth =75
.param ath =4000
* Wheatstone Bridge
.model zbr1 AKO:BZX384B6V2 (Bv=6.42)
* Model Congig
.model bjtp1 AKO:TIP31C (Bf={bth}  ikf=0 )
.param bth =600
* Wheatstone Bridge
* Power Supply
* Input Diff Amplifier
* Thermostat
* Power Block
.model zbr1_ AKO:BZX384B6V2 (Bv=6.42)
.model bjtp1 AKO:TIP31C (Bf={bth_}  ikf=0 )
* Noise
.param noisetime_ 10
.param noiselevel_ 500
* V=white(time*{noisetime_})/{noiselevel_}*4+V(A_)
.param kth_ =75
.param ath_ =4000
.param bth_ =600
.param vdiffos_ =0
.param idiffin_ =0
* .step param kth_ list 67.5 75 82.5
* .step param rp11 list 22k 47k 100k
* .step param rp13 list 100k 500k 1000k
.param rbr4 4k
* .FUNC f_rd(x) {return limit(1k,30k,x)}
.lib UniversalOpamps2.sub
.backanno
.end